# EAGLE design Generador de funciones (EAGLE 7.6.0)
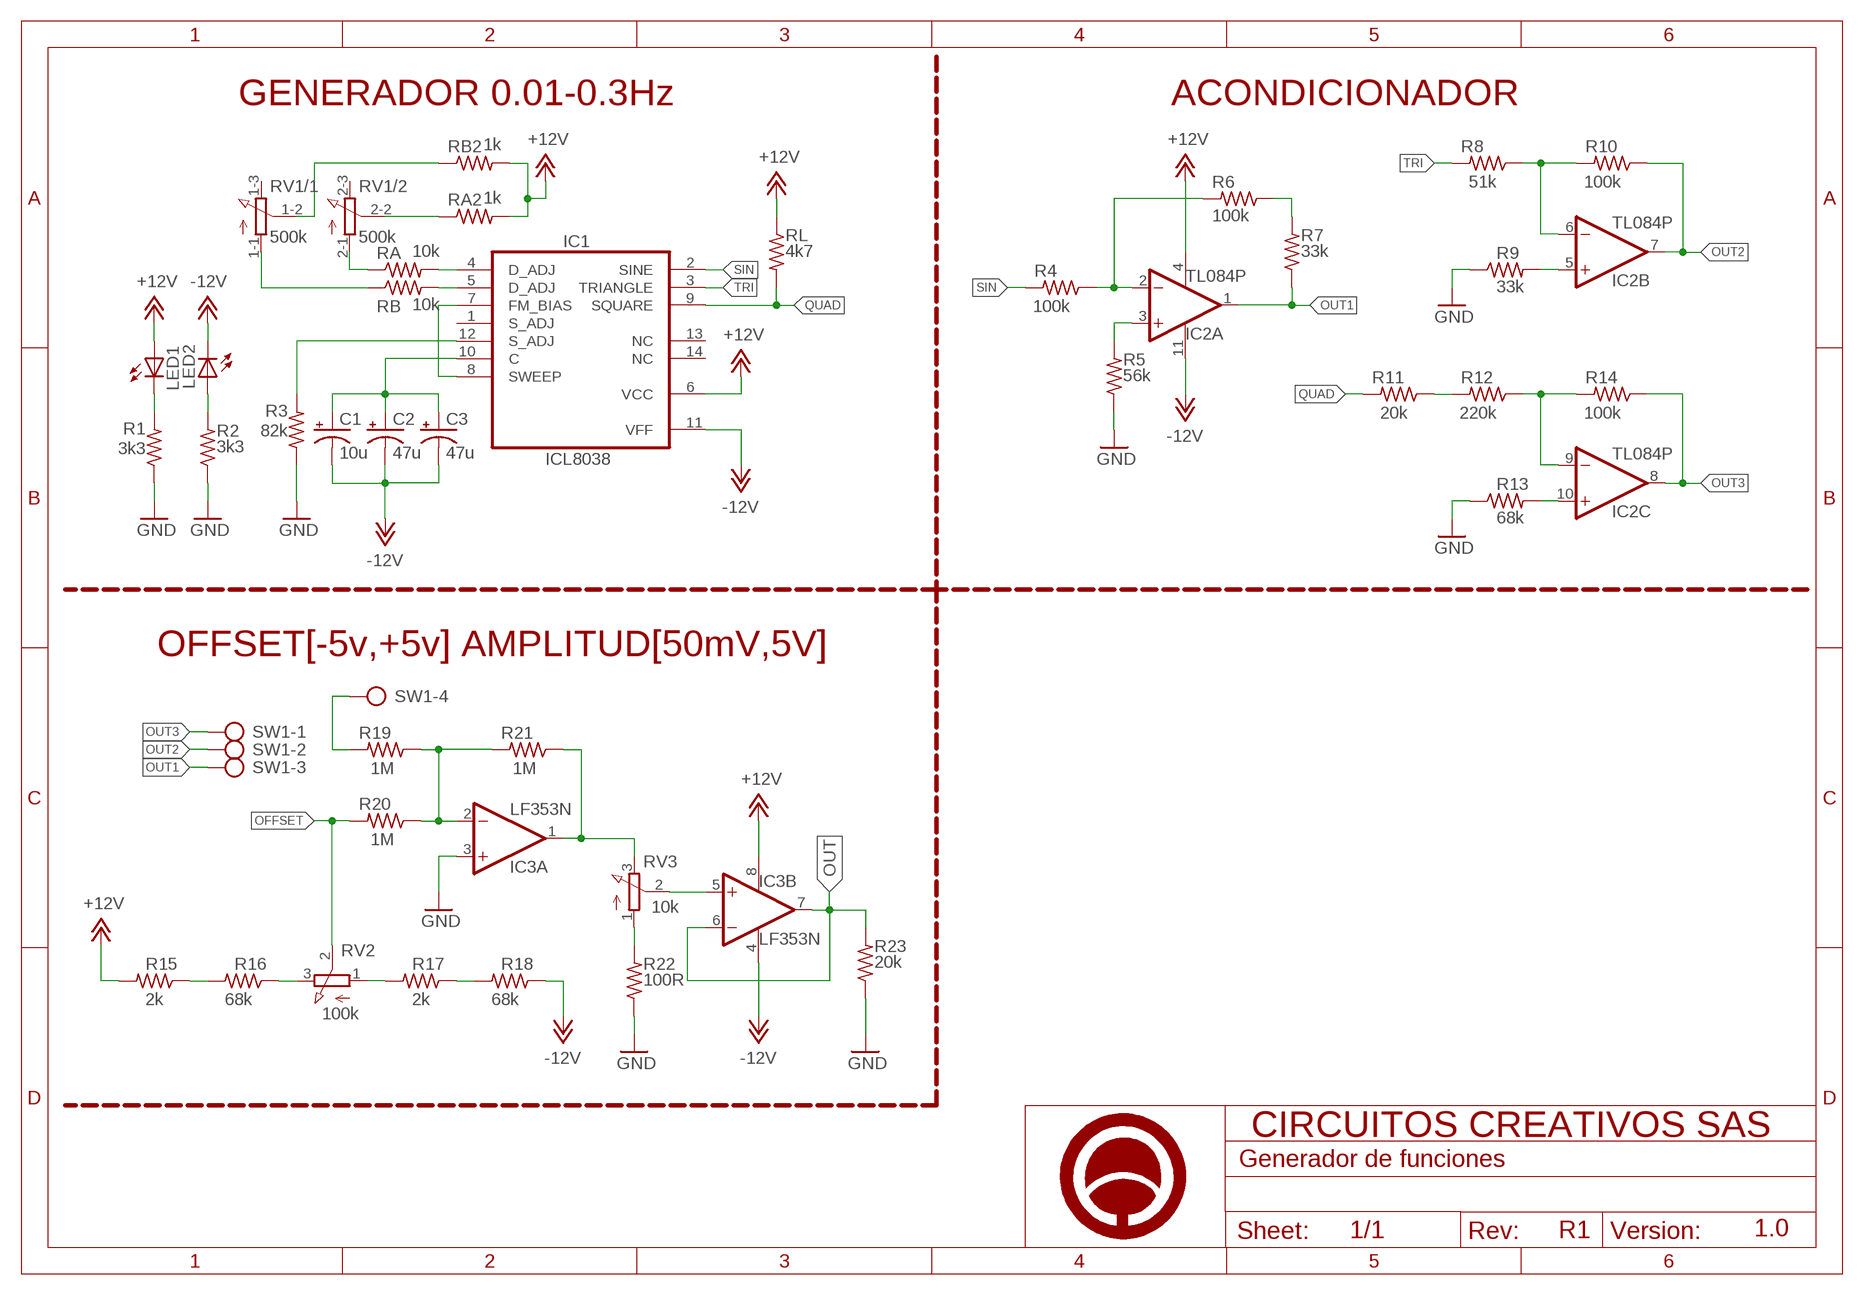
[diagram p0: schematic, sheet 1]

## Parts
C1  10u  CPOL-USE2-5  [E2-5]
C2  47u  CPOL-USE2-5  [E2-5]
C3  47u  CPOL-USE2-5  [E2-5]
FRAME1  A4_HORIZONTAL  [LOGO]
IC1  ICL8038  XR-8038  [DIL14]
IC2  TL084P  [DIL14]
IC3  LF353N  [DIL08]
LED1  LED3MM  [LED3MM]
LED2  LED3MM  [LED3MM]
R1  3k3  R-US_0204/7  [0204/7]
R2  3k3  R-US_0204/7  [0204/7]
R3  82k  R-US_0204/7  [0204/7]
R4  100k  R-US_0204/7  [0204/7]
R5  56k  R-US_0204/7  [0204/7]
R6  100k  R-US_0204/7  [0204/7]
R7  33k  R-US_0204/7  [0204/7]
R8  51k  R-US_0204/7  [0204/7]
R9  33k  R-US_0204/7  [0204/7]
R10  100k  R-US_0204/7  [0204/7]
R11  20k  R-US_0204/7  [0204/7]
R12  220k  R-US_0204/7  [0204/7]
R13  68k  R-US_0204/7  [0204/7]
R14  100k  R-US_0204/7  [0204/7]
R15  2k  R-US_0204/7  [0204/7]
R16  68k  R-US_0204/7  [0204/7]
R17  2k  R-US_0204/7  [0204/7]
R18  68k  R-US_0204/7  [0204/7]
R19  1M  R-US_0204/7  [0204/7]
R20  1M  R-US_0204/7  [0204/7]
R21  1M  R-US_0204/7  [0204/7]
R22  100R  R-US_0204/7  [0204/7]
R23  20k  R-US_0204/7  [0204/7]
RA  10k  R-US_0204/7  [0204/7]
RA2  1k  R-US_0204/7  [0204/7]
RB  10k  R-US_0204/7  [0204/7]
RB2  1k  R-US_0204/7  [0204/7]
RL  4k7  R-US_0204/7  [0204/7]
RV1  500k  3RP/1610G  [3RP/1610G]
RV2  100k  3RP/1610N  [3RP/1610N]
RV3  10k  3RP/1610N  [3RP/1610N]
SW1  AK500/4  [AK500/4]

## Nets
+12V: IC1.6(VCC) IC2.4(P:V+) IC3.8(P:V+) LED1.A R15.2 RA2.2 RB2.2 RL.1
-12V: C1.- C2.- C3.- IC1.11(VFF) IC2.11(P:V-) IC3.4(P:V-) LED2.K(C) R18.1
GND: IC3.3(A:+IN) R1.1 R2.1 R3.1 R5.1 R9.1 R13.1 R22.1 R23.1
N$1: IC1.7(FM_BIAS) IC1.8(SWEEP)
N$2: C1.+ C2.+ C3.+ IC1.10(C)
N$3: IC1.12(S_ADJ) R3.2
N$4: IC1.4(D_ADJ) RA.2
N$5: IC1.5(D_ADJ) RB.2
N$6: RA.1 RV1.2-1(/2:A)
N$7: RB2.1 RV1.1-2(/1:S)
N$8: RB.1 RV1.1-1(/1:A)
N$9: RA2.1 RV1.2-2(/2:S)
N$10: LED1.K(C) R1.2
N$11: LED2.A R2.2
N$12: IC2.3(A:+IN) R5.2
N$13: IC2.2(A:-IN) R4.1 R6.2
N$14: IC2.9(C:-IN) R12.1 R14.2
N$15: R6.1 R7.2
N$16: IC2.6(B:-IN) R8.1 R10.2
N$17: IC2.5(B:+IN) R9.2
N$18: IC2.10(C:+IN) R13.2
N$19: R11.1 R12.2
N$20: R19.2 SW1.4
N$21: IC3.1(A:OUT) R21.1 RV3.3(E)
N$22: IC3.2(A:-IN) R19.1 R20.1 R21.2
N$23: R15.1 R16.2
N$24: R16.1 RV2.3(E)
N$25: R17.2 RV2.1(A)
N$26: R17.1 R18.2
N$27: IC3.5(B:+IN) RV3.2(S)
N$28: R22.2 RV3.1(A)
OFFSET: R20.2 RV2.2(S)
OUT: IC3.6(B:-IN) IC3.7(B:OUT) R23.2
OUT1: IC2.1(A:OUT) R7.1 SW1.3
OUT2: IC2.7(B:OUT) R10.1 SW1.2
OUT3: IC2.8(C:OUT) R14.1 SW1.1
QUAD: IC1.9(SQUARE) R11.2 RL.2
SIN: IC1.2(SINE) R4.2
TRI: IC1.3(TRIANGLE) R8.2
Unconnected: IC1.1(S_ADJ) IC1.13(NC) IC1.14(NC) IC2.12(D:+IN) IC2.13(D:-IN) IC2.14(D:OUT) RV1.1-3(/1:E) RV1.2-3(/2:E)

## Notes on the sheet
- GENERADOR 0.01-0.3Hz | ACONDICIONADOR
- OFFSET[-5v,+5v] AMPLITUD[50mV,5V]
- R1 | 1.0

## Library data of the parts
C1-C3 = rcl:CPOL-US: POLARIZED CAPACITOR, American symbol
FRAME1 = Circuitos-Creativos-Estilos:A4_HORIZONTAL
IC1 = exar:XR-8038: Precision WAVEFORM GENERATOR; OC_FARNELL: unknown; OC_NEWARK: unknown
IC2 = linear:TL084: OP AMP
IC3 = linear:LF353: OP AMP
LED1 LED2 = adafruit:LED: LED OSRAM: - CHIPLED LG R971, LG N971, LY N971, LG Q971, LY Q971, LO R971, LY R971 LH N974, LH R974 LS Q976, LO Q976, LY Q976 LO Q996 - Hyper CHIPLED LW Q18S LB Q993, LB Q99A, LB R99A - SideLED LS A670, LO A670, LY A670, LG A670, LP A670 LB A673, LV A673, LT A673, LW A673 LH A674 LY A675 LS A676, LA A676, LO A676, LY A676, LW A676 LS A679, LY A679, LG A679 - Hyper Micro SIDELED® LS Y876, LA Y876, LO Y876, LY Y876 LT Y87S - SmartLED LW L88C, LW L88S LB L89C, LB L89S, LG L890 LS L89K, LO L89K, LY L89K LS L896, LA L896, LO L896, LY L896 - TOPLED LS T670, LO T670, LY T670, LG T670, LP T670 LSG T670, LSP T670, LSY T670, LOP T670, LYG T670 LG T671, LOG T671, LSG T671 LB T673, LV T673, LT T673, LW T673 LH T674 LS T676, LA T676, LO T676, LY T676, LB T676, LH T676, LSB T676, LW T676 LB T67C, LV T67C, LT T67C, LS T67K, LO T67K, LY T67K, LW E67C LS E67B, LA E67B, LO E67B, LY E67B, LB E67C, LV E67C, LT E67C LW T67C LS T679, LY T679, LG T679 LS T770, LO T770, LY T770, LG T770, LP T770 LB T773, LV T773, LT T773, LW T773 LH T774 LS E675, LA E675, LY E675, LS T675 LS T776, LA T776, LO T776, LY T776, LB T776 LHGB T686 LT T68C, LB T68C - Hyper Mini TOPLED® LB M676 - Mini TOPLED Santana® LG M470 LS M47K, LO M47K, LY M47K Source: http://www.osram.convergy.de/
R1-R23 RA RA2 RB RB2 RL = resistor:R-US_: RESISTOR, American symbol
RV1 = pot:3RP/1610G: 16mm Potentiometer two level Source: http://www.alphapotentiometers.net/html/16mm_pot_2.html
RV2 RV3 = pot:3RP/1610N: 16mm Potentiometer one level Source: http://www.alphapotentiometers.net/html/16mm_pot_2.html
SW1 = con-ptr500:AK500/4: CONNECTOR; OC_FARNELL: unknown; OC_NEWARK: unknown

## Board
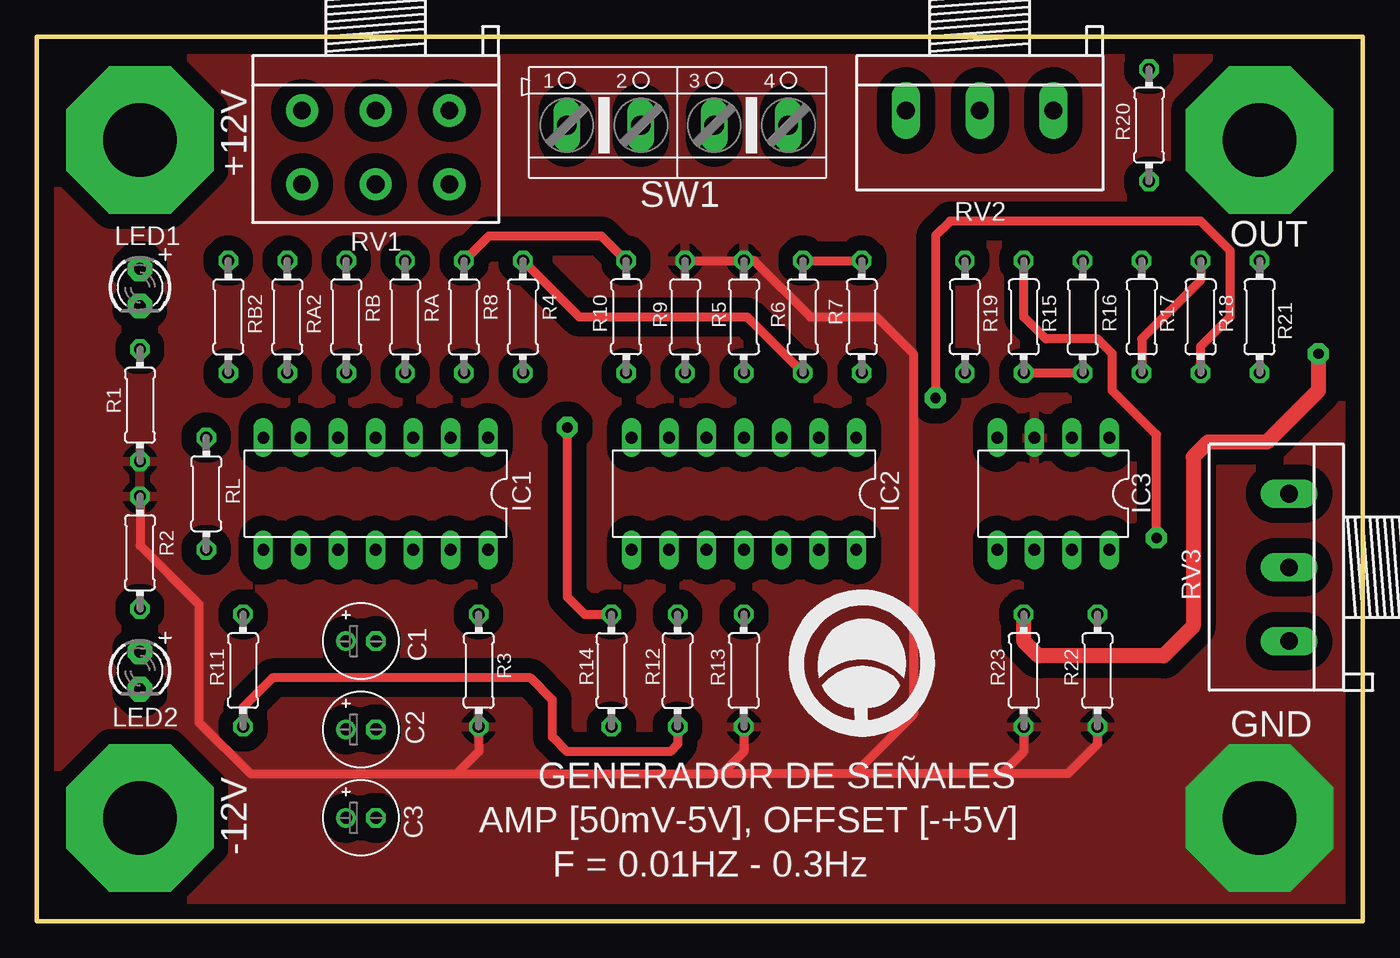
[diagram p1: board, top side]
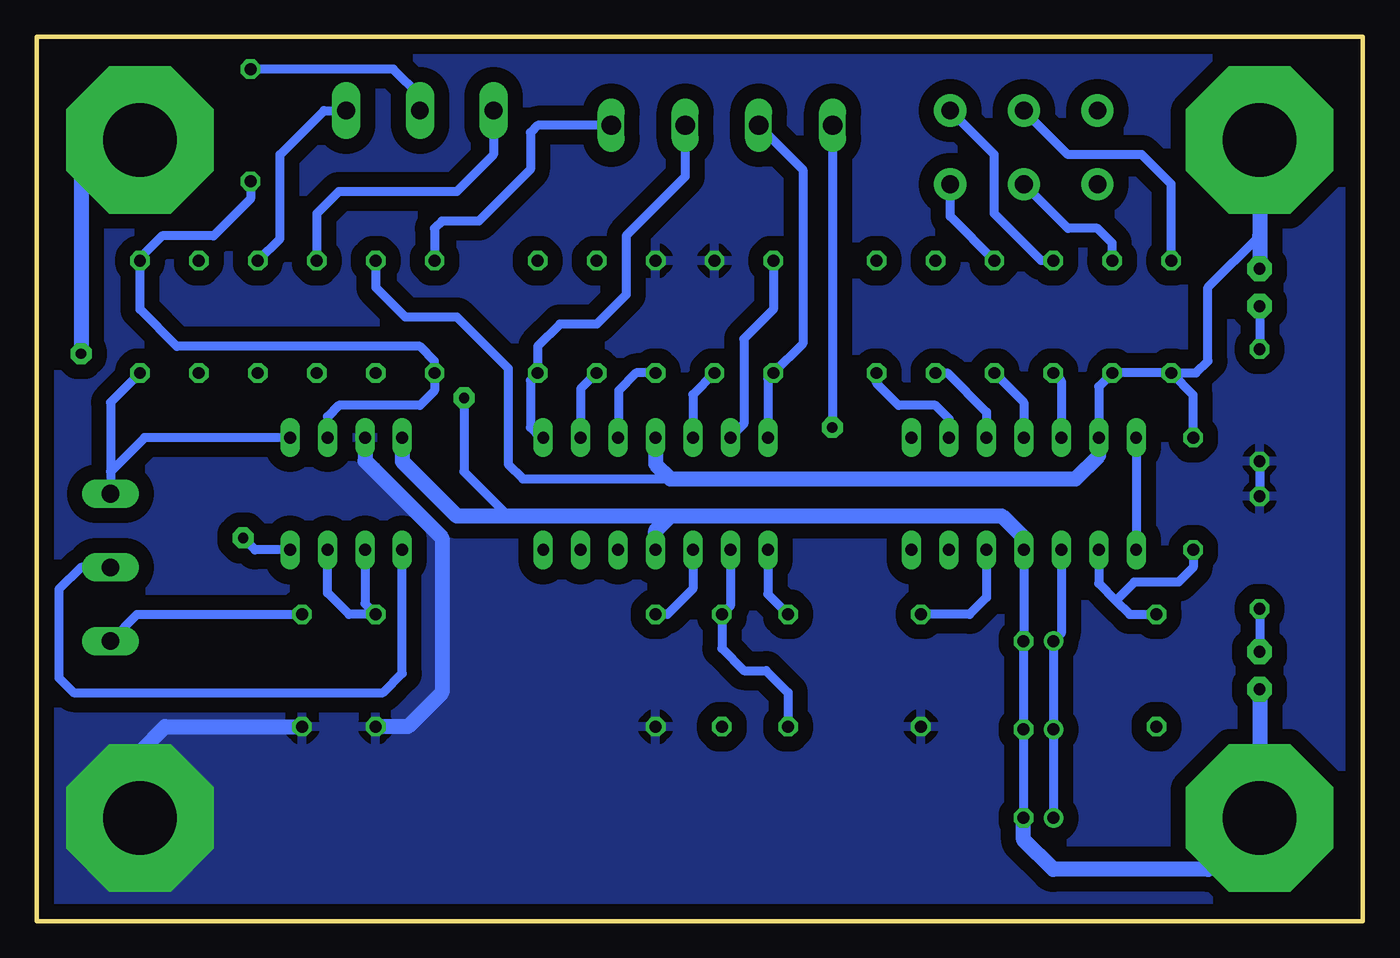
[diagram p2: board, bottom side, seen from below]

Size 90 x 60 mm. Coordinates in mm from the lower left corner, seen from the top.
Outline: 0,0 90,0 90,60 0,60 0,0
Copper layers (1*16): Top 0.035mm / dielectric 1.5mm / Bottom 0.035mm
Design rules "DRC_Serigrafia_2capa *": minimum track width 24mil, minimum drill 0.7mm, track to track 15mil, track to pad 15mil, pad to pad 15mil, via to via 15mil, smd to smd 10mil, copper to edge 40mil, drill to drill 15mil, minimum pad ring 10mil, minimum via ring 10mil, stop-mask expansion 4mil, vias tented up to drill 0mil, thermal gap 20mil

### Footprints (pad centres in the part's own frame; a part is rotated, then mirrored left to right if it is on the bottom)
E2-5 = drill 0.813 pad 1.27: + -1.016,0 | drill 0.813 pad 1.27 octagon: - 1.016,0
DIL14 = drill 0.813 long: 1 -7.62,-3.81; 2 -5.08,-3.81; 3 -2.54,-3.81; 4 0,-3.81; 5 2.54,-3.81; 6 5.08,-3.81; 7 7.62,-3.81; 8 7.62,3.81; 9 5.08,3.81; 10 2.54,3.81; 11 0,3.81; 12 -2.54,3.81; 13 -5.08,3.81; 14 -7.62,3.81
DIL08 = drill 0.813 pad 1.27 long: 1 -3.81,-3.81; 2 -1.27,-3.81; 3 1.27,-3.81; 4 3.81,-3.81; 5 3.81,3.81; 6 1.27,3.81; 7 -1.27,3.81; 8 -3.81,3.81
LED3MM = drill 0.813 pad 1.676 octagon: A -1.27,0; K 1.27,0
0204/7 = drill 0.813 octagon: 1 -3.81,0; 2 3.81,0
3RP/1610G = drill 1.2 pad 2.184: 1-1 -5,0; 1-2 0,0; 1-3 5,0; 2-1 -5,5; 2-2 0,5; 2-3 5,5
3RP/1610N = drill 1.2 pad 1.93 long: 1 -5,0; 2 0,0; 3 5,0
AK500/4 = drill 1.321 long: 1 -7.518,0; 2 -2.489,0; 3 2.489,0; 4 7.518,0

### Placement (x,y rotation side)
C1  22,19 0 top
C2  22,13 0 top
C3  22,7 0 top
FRAME1  56,17.5 0 top
IC1  23,29 180 top
IC2  48,29 180 top
IC3  69,29 180 top
LED1  7,43 270 top
LED2  7,17 270 top
R1  7,35 90 top
R2  7,25 270 top
R3  30,17 90 top
R4  33,41 270 top
R5  48,41 270 top
R6  52,41 270 top
R7  56,41 90 top
R8  29,41 270 top
R9  44,41 270 top
R10  40,41 90 top
R11  14,17 90 top
R12  43.5,17 270 top
R13  48,17 90 top
R14  39,17 270 top
R15  67,41 90 top
R16  71,41 270 top
R17  75,41 90 top
R18  79,41 90 top
R19  63,41 90 top
R20  75.5,54 90 top
R21  83,41 90 top
R22  72,17 90 top
R23  67,17 90 top
RA  25,41 270 top
RA2  17,41 270 top
RB  21,41 270 top
RB2  13,41 270 top
RL  11.5,29 270 top
RV1  23,55 180 top
RV2  64,55 180 top
RV3  85,24 90 top
SW1  43.5,54 0 top

### Tracks (layer width: path | path; a pad name or v marks a point on that pad's centre or on a via)
+12V  (via drill 0.7 pad 1.42, 5 pad 10)
  Top 0.61: v76,26 76,33 73,36 73,38.5 72,39.5 68.5,39.5 67,41 R15.2
  Bottom 0.61: IC1.6 17.92,36.27 RA2.2 RB2.2 | RL.1 11.5,35.69 RB2.2 | RB2.2 11.31,37.19 10.5,38 10.5,43 7,46.5 | R15.2 67,43 65,41 61.5,41 58,37.5 58,31 57,30 47,30 | IC3.8 75.19,25.19 v76,26
  Bottom 1.016: IC2.4 48,31 47,30 19.5,30 17.92,31.58 IC1.6 | v7,53 7,46.5 LED1.A
-12V  (via drill 0.7 pad 1.42, 5 pad 10)
  Top 0.61: R18.1 79,39 81,41 81,45.5 79,47.5 62,47.5 61,46.5 v61,35.5
  Bottom 0.61: IC1.11 23,19.02 C1.- C2.- C3.- | v61,35.5 61,30.5 58,27.5
  Bottom 1.016: IC2.11 48,26.5 47,27.5 | 47,27.5 24.5,27.5 23,26 IC1.11 | LED2.K v7,7 10.5,3.5 21,3.5 23.02,5.52 C3.- | 47,27.5 58,27.5 61.5,27.5 65.19,31.19 IC3.4
GND  (via drill 5 pad 10)
  Top 0.61: R22.1 72,12 70,10 65.5,10 | 65.5,10 55.5,10 | 55.5,10 46.5,10 | R2.1 7,25.5 11,21.5 11,13.5 14.5,10 28.5,10 | R23.1 67,11.5 65.5,10 | R13.1 48,11.5 46.5,10 | 28.5,10 46.5,10 | R3.1 30,11.5 28.5,10 | R9.1 R5.1 48.69,44.81 52.5,41 57,41 59.5,38.5 59.5,14 55.5,10
  Bottom 0.61: R1.1 R2.1
  Bottom 1.016: R22.1 81.31,13.19 83,11.5 v83,7 | IC3.3 67.73,31.23 62.5,26 62.5,15.5 64.81,13.19 R23.1
  pour Bottom (isolate 1.016): -1,-1 -1,61 91,61 91,-1
  pour Top (isolate 1.016): -2,-2 -2,62 92,62 92,-2
N$1
  Bottom 0.61: IC1.7 IC1.8
N$2
  Bottom 0.61: IC1.10 20.46,19.52 C1.+ C2.+ C3.+
N$3
  Bottom 0.61: IC1.12 25.54,21.96 26.69,20.81 R3.2
N$4
  Bottom 0.61: RA.2 23,35.19 IC1.4
N$5
  Bottom 0.61: RB.2 20.46,36.65 IC1.5
N$6
  Bottom 0.61: RA.1 28,47.81 RV1.2-1
N$7
  Bottom 0.61: RB2.1 13,50 15,52 20,52 RV1.1-2
N$8
  Bottom 0.61: RB.1 21.81,44.81 25,48 25,52 RV1.1-1
N$9
  Bottom 0.61: RA2.1 17,46 18,47 20,47 RV1.2-2
N$10
  Bottom 0.61: LED1.K R1.2
N$11
  Bottom 0.61: R2.2 LED2.A
N$12
  Bottom 0.61: R5.2 49.31,37.19 50.5,36 50.5,32.85 IC2.3
N$13
  Top 0.61: R4.1 36.81,41 48.19,41 R6.2
  Bottom 0.61: R6.2 53.08,36.11 IC2.2
N$14
  Bottom 0.61: IC2.9 42.92,21.39 R12.1 43.5,18.5 42,17 40.5,17 39,15.5 R14.2
N$15
  Top 0.61: R6.1 R7.2
N$16
  Top 0.61: R8.1 30.69,46.5 38.31,46.5 R10.2
  Bottom 0.61: R10.2 40,41.5 42,39.5 42,33.73 IC2.6
N$17
  Bottom 0.61: R9.2 45.46,35.73 IC2.5
N$18
  Bottom 0.61: IC2.10 45.46,22.54 47.19,20.81 R13.2
N$19
  Top 0.61: R12.2 43.5,12 43,11.5 36,11.5 35,12.5 35,15 33.5,16.5 16,16.5 14,14.5 R11.1
N$20
  Bottom 0.61: SW1.4 56,54 56.5,53.5 56.5,51 60,47.5 62.5,47.5 63,47 R19.2
N$21
  Bottom 0.61: IC3.1 82.69,32.81 85,30.5 | 85,30.5 RV3.3 | R21.1 85,35.19 85,30.5
N$22
  Bottom 0.61: R20.1 75.5,49 78,46.5 81.5,46.5 83,45 R21.2 83,41.5 80.5,39 64,39 63,38 R19.1 63,36 64,35 69.5,35 70.27,34.23 IC3.2
N$23
  Top 0.61: R15.1 R16.2
N$24
  Bottom 0.61: RV2.3 59,52 61.5,49.5 69.5,49.5 71,48 R16.1
N$25
  Bottom 0.61: R17.2 73.5,46.31 73.5,52 70.5,55 RV2.1
N$26
  Top 0.61: R18.2 79,43.5 75,39.5 R17.1
N$27
  Bottom 0.61: RV3.2 87,24 88.5,22.5 88.5,16.5 87.5,15.5 66.5,15.5 65.19,16.81 IC3.5
N$28
  Bottom 0.61: RV3.1 83.19,20.81 R22.2
OFFSET
  Bottom 0.61: RV2.2 64,56 65.81,57.81 R20.2
OUT  (via drill 0.7 pad 1.42, 5 pad 10)
  Top 1.016: v87,38.5 87,36 83.5,32.5 79.5,32.5 78.5,31.5 78.5,20 76.5,18 68,18 67,19 R23.2
  Bottom 0.61: IC3.7 70.27,22.27 68.81,20.81 R23.2 67.73,21.54 IC3.6
  Bottom 1.016: v83,53 85.5,53 87,51.5 v87,38.5
OUT1
  Bottom 0.61: IC2.1 55.81,32.81 56.5,33.5 56.5,36.69 R7.1 56,39 54.5,40.5 52,40.5 50,42.5 50,46.5 45.99,50.51 SW1.3
OUT2
  Bottom 0.61: IC2.7 40.38,36.81 R10.1 38,39.19 38,50.99 SW1.2
OUT3  (via drill 0.7 pad 1.42)
  Top 0.61: v36,33.5 36,22 37.19,20.81 R14.1
  Bottom 0.61: IC2.8 40.38,22.19 R14.1 | SW1.1 35.98,33.52 v36,33.5
QUAD
  Bottom 0.61: IC1.9 17.92,22.92 16.75,21.75 | 16.75,21.75 15.81,20.81 R11.2 | RL.2 11.5,24 12.5,23 15.5,23 16.75,21.75
SIN
  Bottom 0.61: IC1.2 28.08,34.08 29,35 31.5,35 33,36.5 R4.2
TRI
  Bottom 0.61: R8.2 28.19,37.19 25.54,34.54 IC1.3

### Text on the board
tPlace: +12V | OUT | GND | GENERADOR DE SEÑALES | AMP [50mV-5V], OFFSET [-+5V] | -12V | F = 0.01HZ - 0.3Hz